# EAGLE design PCB Test (EAGLE 5.11)
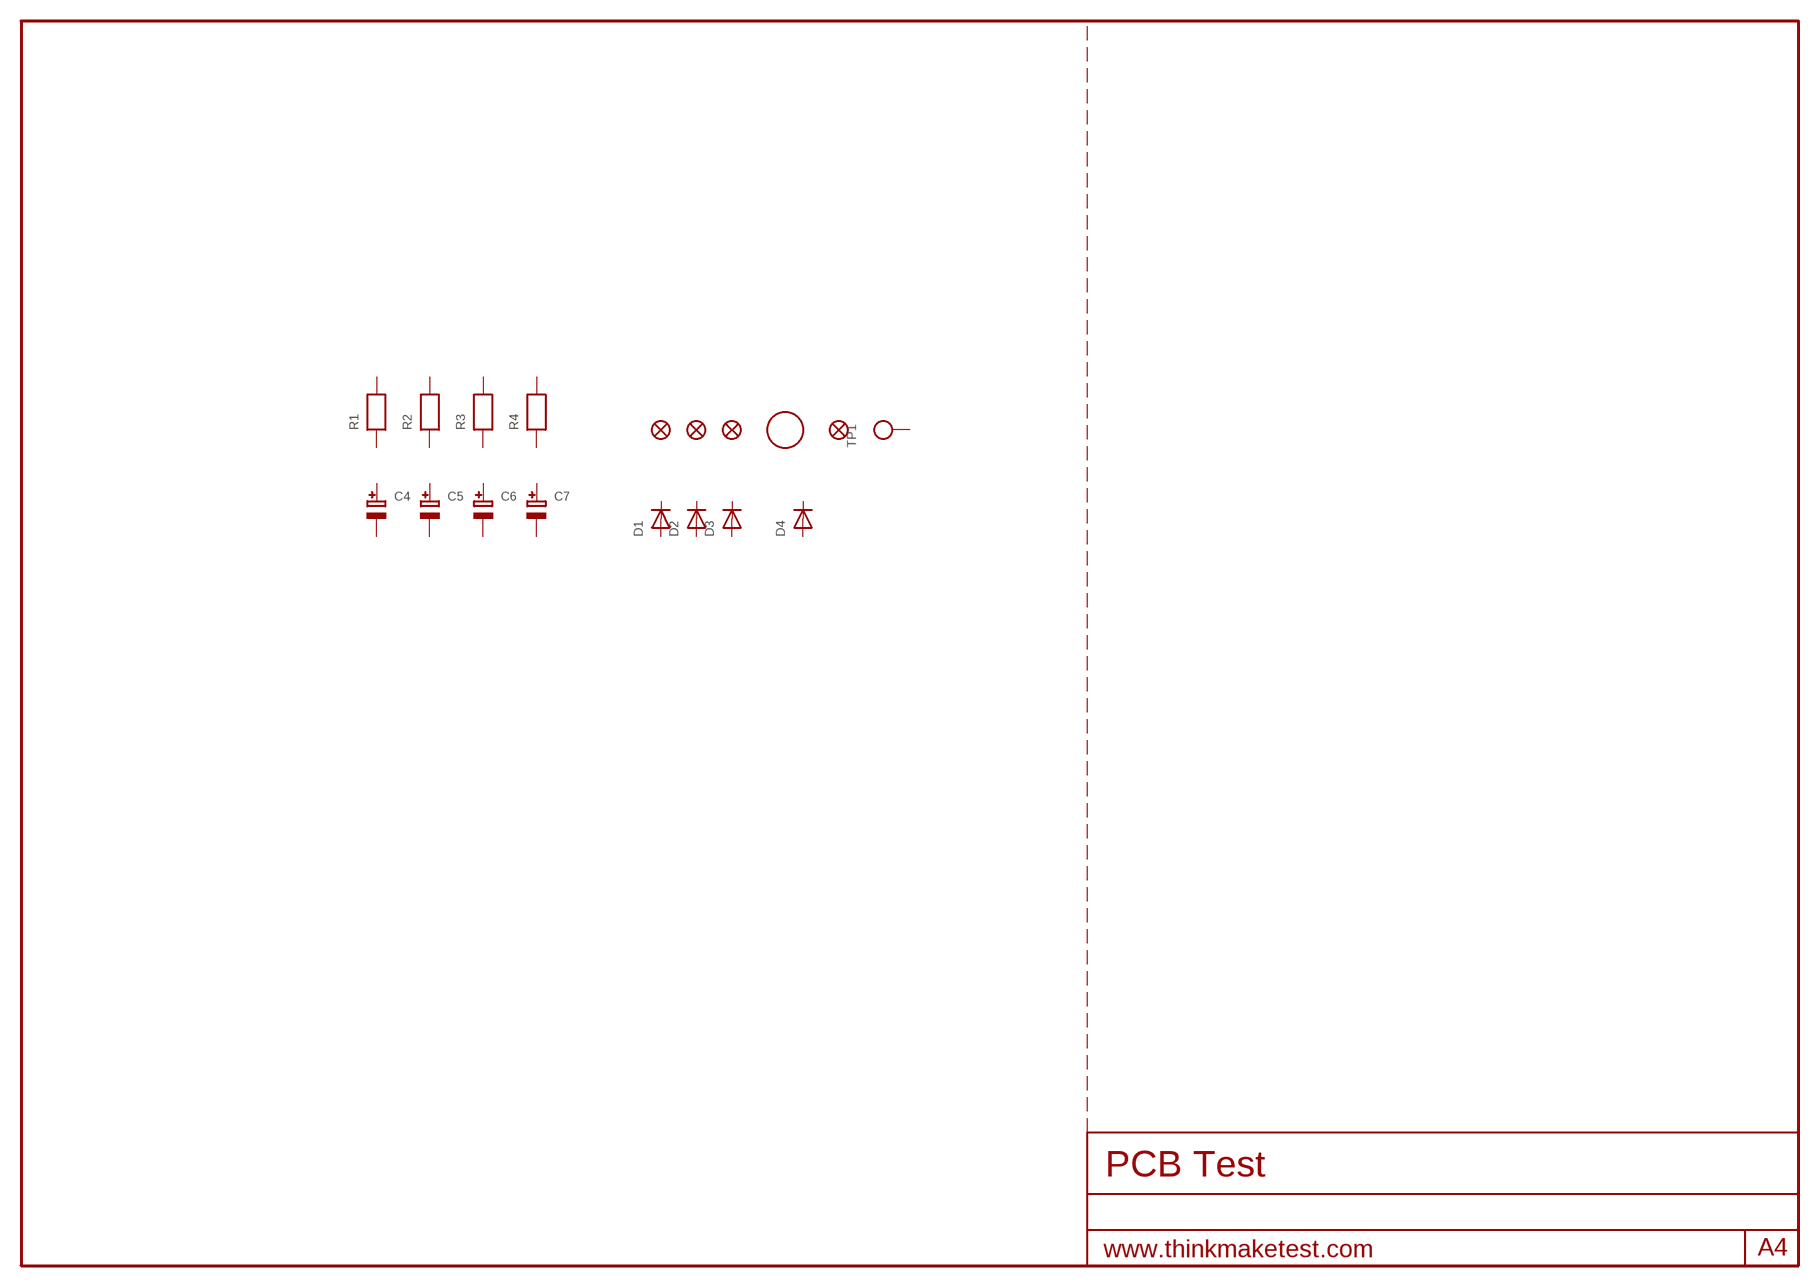
[diagram p0: schematic, sheet 1]

## Parts
C4  CAP_TANTALUMA/3216_REFLOW  [EIA3216-18/A-R]
C5  CAP_TANTALUMB/3528_REFLOW  [EIA3528-21/B-R]
C6  CAP_TANTALUMC/6032_REFLOW  [EIA6032-28/C-R]
C7  CAP_TANTALUMD/7343_REFLOW  [EIA7343-31/D-R]
D1  DIODESOD-123  [SOD-123]
D2  DIODESOD-323  [SOD-323]
D3  DIODESOD-523  [SOD-523]
D4  DIODESOT23_REFLOW  [SOT23-R]
FID1  FIDUCIAL1X2.5  [FIDUCIAL-1X2.5]
JP1  FIDUCIAL1.5X3  [FIDUCIAL-1.5X3]
JP2  FIDUCIAL1X2  [FIDUCIAL-1X2]
JP3  FIDUCIAL1X2.5  [FIDUCIAL-1X2.5]
R1  RESISTOR0402  [0402]
R2  RESISTOR0603  [0603]
R3  RESISTOR0805  [0805]
R4  RESISTOR1206  [1206]
TP1  TESTPOINTROUND2MM  [TESTPOINT_ROUND_2MM]
U$2  FIDUCIAL  [FIDUCIAL_1MM]
Unconnected: C4.+ C4.- C5.+ C5.- C6.+ C6.- C7.+ C7.- D1.A D1.C D2.A D2.C D3.A D3.K(C) D4.1(A) D4.3(C) R1.1 R1.2 R2.1 R2.2 R3.1 R3.2 R4.1 R4.2 TP1.P$1

## Library data of the parts
C4-C7 = microbuilder:CAP_TANTALUM: Tantalum Capacitors Wave footprints have larger pads and are meant to be used for hand soldering. Reflow footprints are optimised for solder paste and a reflow oven. EIA3216-18/A-[R/W] - Size A / 3216-18 / 1206 footprint 4.7µF 25V 10% Tantalum Capacitor 10µF 16V 10% Tantalum Capacitor [Digikey: 495-2236-2-ND] EIA3528-21/B-[R/W] - Size B / 3528-21 47µF 10V 10% Tantalum Capactior [Digikey: 495-2216-1-ND] EIA6032-28/C-[R/W] - Size C / 6032-28 10µF 35V 20% Tantalum Capacitor [Digikey: 495-2285-1-ND] 100µF 16V 10% Tantalum Capactior [Digikey: 399-5214-1-ND]
D1-D4 = microbuilder:DIODE: Diode SMADIODE - SMA Surface Mount Package 20V 1A Schottky Diode Digikey (500mV @ 1A, 500uA Vr @ 20V): 641-1014-6-ND SOD-123 30V 500mA (430mV Vf, 130uA Vr @ 30V) Schottky Diode - Digikey: B0530W-FDICT-ND SOD-323 10V 570mA (380mV Vf, 3ns) Schottky Diode - Digikey: ZLLS410CT-ND SOD-523 30V 30mA Schottky Diode (RB751S-40TE61) - Digikey: RB751S-40TE61CT-ND SOT23-R/W - SOT23 Package (R = Solder Paste/Reflow Ovens, W = Hand-Soldering) BAT54Film 40V 300mA - Digikey: 497-7162-1-ND DO-1N4148 Through Hole Small Current Diode (any model)
FID1 = microbuilder:FIDUCIAL: Fiducial Alignment Points Various fiducial points for machine vision alignment.
JP1-JP3 = SparkFun:FIDUCIAL: Fiducial Alignment Points Various fiducial points for machine vision alignment.
R1-R4 = microbuilder:RESISTOR: Resistors 0402 - 0402 Surface Mount Package 10.0K 1% 1/16W [Digikey: 311-10.0KLRTR-ND] 0603 - 0603 Surface Mount Package 0 Ohm 1/10 Watt 1% Resistor 15 Ohm 1/10 Watt 1% Resistor 33 Ohm 1/10 Watt 1% Resistor 49.9 Ohm 1/10 Watt 1% Resistor 100 Ohm 1/10 Watt 1% Resistor 150 Ohm 1/10 Watt 1% Resistor 240 Ohm 1/10 Watt 1% Resistor 390 Ohm 1/10 Watt 1% Resistor 560 Ohm 1/10 Watt 1% Resistor 750 Ohm 1/10 Watt 1% Resistor 1.0K Ohm 1/10 Watt 1% Resistor 1.5K Ohm 1/10 Watt 1% Resistor 2.0K Ohm 1/10 Watt 1% Resistor 4.7K Ohm 1/10 Watt 1% Resistor 10.0K Ohm 1/10 Watt 1% Resistor 20.0K Ohm 1/10 Watt 1% Resistor 33.0K Ohm 1/10 Watt 1% Resistor 100.0K Ohm 1/10 Watt 1% Resistor 0805 - 0805 Surface Mount Package 0 Ohm 1/8 Watt 1% Resistor 33 Ohm 1/8 Watt 1% Resistor 100 Ohm 1/8 Watt 1% Resistor 150 Ohm 1/8 Watt 1% Resistor 200 Ohm 1/8 Watt 1% Resistor 240 Ohm 1/8 Watt 1% Resistor 330 Ohm 1/8 Watt 1% Resistor 390 Ohm 1/8 Watt 1% Resistor 470 Ohm 1/8 Watt 1% Resistor 1.0K Ohm 1/8 Watt 1% Resistor 1.5K Ohm 1/8 Watt 1% Resistor 2.0K Ohm 1/8 Watt 1% Resistor 4.7K Ohm 1/8 Watt 1% Resistor 5.1K Ohm 1/8 Watt 1% Resistor 5.6K Ohm 1/8 Watt 1% Resistor 10.0K Ohm 1/8 Watt 1% Resistor 22.0K Ohm 1/8 Watt 1% Resistor 33.0K Ohm 1/8 Watt 1% Resistor 100K Ohm 1/8 Watt 1% Resistor 1206 - 1206 Surface Mount Package
TP1 = microbuilder:TESTPOINT: Test Point TESTPOINT_SMT - Compact Surface Mount Test Point [Digikey: 5016KTR-ND] TESTPOINT_PAD - Square Pad (2mm) TESTPOINT_SMT - Round Pad (2mm)
U$2 = adafruit:FIDUCIAL: For use by pick and place machines to calibrate the vision/machine, 1mm By microbuilder.eu

## Board
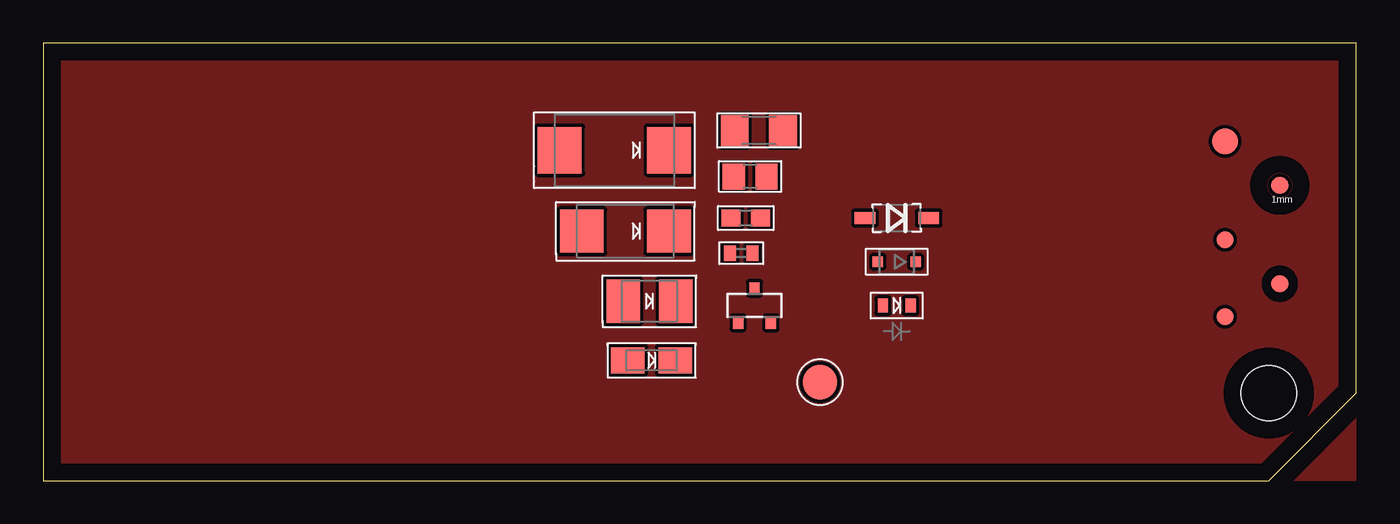
[diagram p1: board, top side]

Size 76.2 x 25.4 mm. Coordinates in mm from the lower left corner, seen from the top.
Outline: 0,0 71.12,0 76.2,5.08 76.2,25.4 0,25.4 0,0
Copper layers (1*16): Top 0.035mm / dielectric 1.5mm / Bottom 0.035mm
Design rules "default": minimum track width 10mil, minimum drill 24mil, track to track 8mil, track to pad 8mil, pad to pad 8mil, via to via 8mil, smd to smd 8mil, copper to edge 40mil, drill to drill 8mil, minimum pad ring 10mil, minimum via ring 8mil, stop-mask expansion 4mil, vias tented up to drill 0mil, thermal gap 10mil
Holes 3.2 mm at 71.12,5.08

### Footprints (pad centres in the part's own frame; a part is rotated, then mirrored left to right if it is on the bottom)
EIA3216-18/A-R = smd 1.95 x 1.5: + 1.375,0; - -1.375,0
EIA3528-21/B-R = smd 1.95 x 2.5: + 1.525,0; - -1.525,0
EIA6032-28/C-R = smd 2.55 x 2.5: + 2.525,0; - -2.525,0
EIA7343-31/D-R = smd 2.55 x 2.7: + 3.175,0; - -3.175,0
SOD-123 = smd 1.2 x 0.7: A 1.85,0; C -1.85,0
SOD-323 = smd 0.6 x 0.6: A 1.1,0; C -1.1,0
SOD-523 = smd 0.8 x 0.6: A 0,-0.8; K 0,0.8
SOT23-R = smd 0.6 x 0.7: 1 -0.95,-1; 2 0.95,-1; 3 0,1
FIDUCIAL-1X2.5 = smd 1 x 1: 1 0,0
FIDUCIAL-1.5X3 = smd 1.5 x 1.5: 1 0,0
FIDUCIAL-1X2 = smd 1 x 1: 1 0,0
0402 = smd 0.7 x 0.9: 1 -0.65,0; 2 0.65,0
0603 = smd 1.1 x 1: 1 -0.85,0; 2 0.85,0
0805 = smd 1.3 x 1.5: 1 -0.95,0; 2 0.95,0
1206 = smd 1.6 x 1.8: 1 -1.4,0; 2 1.4,0
TESTPOINT_ROUND_2MM = smd 2 x 2: P$1 0,0
FIDUCIAL_1MM = smd 1 x 1: 1 0,0

### Placement (x,y rotation side)
C4  35.31,6.99 0 top
C5  35.18,10.41 0 top
C6  33.78,14.48 0 top
C7  33.15,19.18 0 top
D1  49.53,15.24 180 top
D2  49.53,12.7 180 top
D3  49.53,10.16 270 top
D4  41.27,10.16 0 top
FID1  71.75,17.14 0 top
JP1  68.58,19.68 0 top
JP2  68.58,9.53 0 top
JP3  68.58,13.97 0 top
R1  40.51,13.21 180 top
R2  40.77,15.24 180 top
R3  41.02,17.65 180 top
R4  41.53,20.32 180 top
TP1  45.09,5.71 0 top
U$2  71.75,11.43 0 top

### Tracks (layer width: path | path; a pad name or v marks a point on that pad's centre or on a via)
N$1
  pour Top: 0,0 76.2,0 76.2,25.4 0,25.4

### Text on the board
tStop: 0 | 1 | 2 | 3 | 0 | 1 | 2 | 3 | 4 | 5 | 6
tDocu: R4 | Widths | 100% | 70 | R3 | 66 | R2 | 150% | 60 | R1 | 50 | 40 | 32 | 24 | 200% | 20 | 16 | 12 | 10